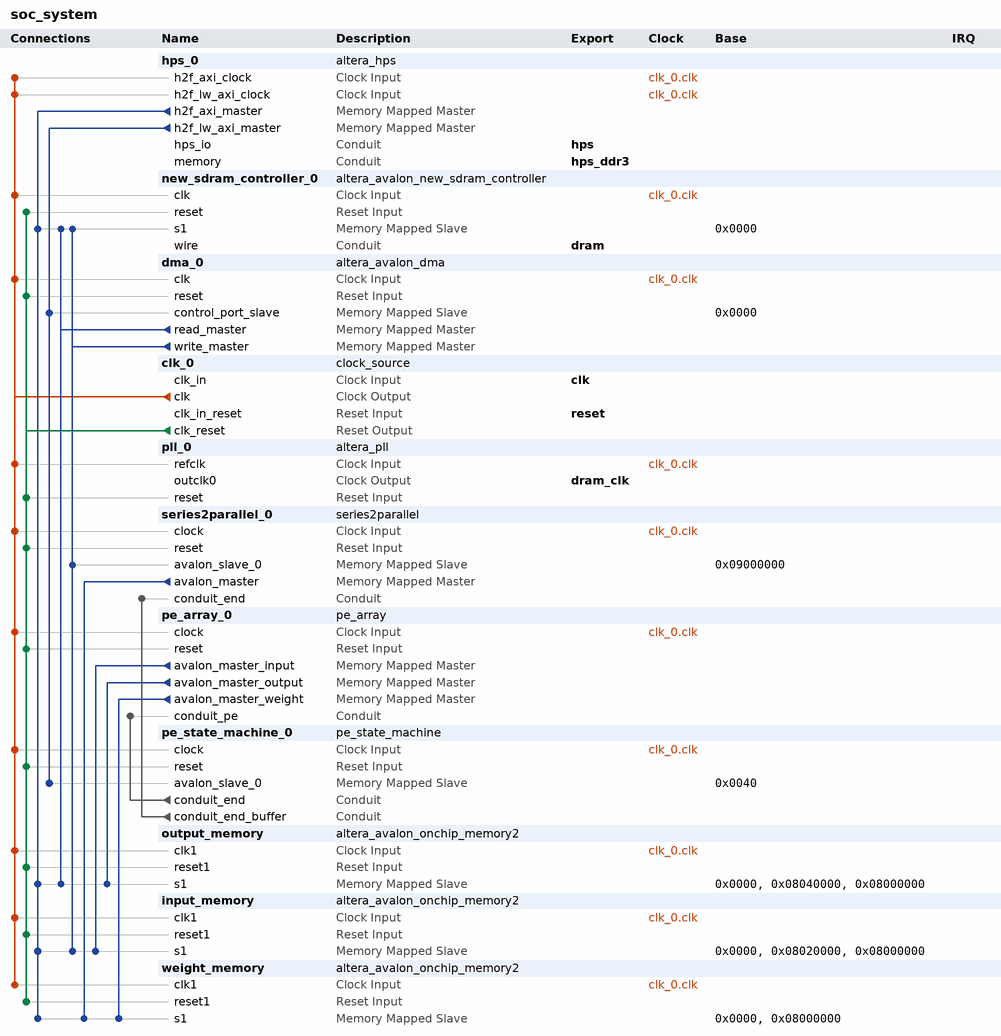
[diagram p0: system contents]
# Platform Designer (Qsys) system soc_system, Cyclone V 5CSEMA5F31C6
# Parameters at their usual value, and those the tool derives, are not listed.
package require -exact qsys 18.1
create_system soc_system
set_project_property DEVICE_FAMILY {Cyclone V}
set_project_property DEVICE 5CSEMA5F31C6

add_instance hps_0 altera_hps 18.1
set_instance_parameter_value hps_0 EMAC1_Mode RGMII
set_instance_parameter_value hps_0 EMAC1_PinMuxing {HPS I/O Set 0}
set_instance_parameter_value hps_0 F2SCLK_COLDRST_Enable false
set_instance_parameter_value hps_0 F2SCLK_DBGRST_Enable false
set_instance_parameter_value hps_0 F2SCLK_WARMRST_Enable false
set_instance_parameter_value hps_0 F2SINTERRUPT_Enable true
set_instance_parameter_value hps_0 F2S_Width 0
set_instance_parameter_value hps_0 FPGA_PERIPHERAL_OUTPUT_CLOCK_FREQ_EMAC0_GTX_CLK 125
set_instance_parameter_value hps_0 FPGA_PERIPHERAL_OUTPUT_CLOCK_FREQ_EMAC0_MD_CLK 2.5
set_instance_parameter_value hps_0 FPGA_PERIPHERAL_OUTPUT_CLOCK_FREQ_EMAC1_GTX_CLK 125
set_instance_parameter_value hps_0 FPGA_PERIPHERAL_OUTPUT_CLOCK_FREQ_EMAC1_MD_CLK 2.5
set_instance_parameter_value hps_0 HPS_PROTOCOL DDR3
set_instance_parameter_value hps_0 I2C0_Mode I2C
set_instance_parameter_value hps_0 I2C0_PinMuxing {HPS I/O Set 0}
set_instance_parameter_value hps_0 I2C1_Mode I2C
set_instance_parameter_value hps_0 I2C1_PinMuxing {HPS I/O Set 0}
set_instance_parameter_value hps_0 LWH2F_Enable true
set_instance_parameter_value hps_0 MEM_BANKADDR_WIDTH 3
set_instance_parameter_value hps_0 MEM_CLK_FREQ 400.0
set_instance_parameter_value hps_0 MEM_COL_ADDR_WIDTH 10
set_instance_parameter_value hps_0 MEM_DQ_WIDTH 32
set_instance_parameter_value hps_0 MEM_DRV_STR RZQ/7
set_instance_parameter_value hps_0 MEM_ROW_ADDR_WIDTH 15
set_instance_parameter_value hps_0 MEM_RTT_NOM RZQ/4
set_instance_parameter_value hps_0 MEM_RTT_WR RZQ/4
set_instance_parameter_value hps_0 MEM_TCL 11
set_instance_parameter_value hps_0 MEM_TFAW_NS 30.0
set_instance_parameter_value hps_0 MEM_TRAS_NS 35.0
set_instance_parameter_value hps_0 MEM_TRCD_NS 13.75
set_instance_parameter_value hps_0 MEM_TRFC_NS 260.0
set_instance_parameter_value hps_0 MEM_TRP_NS 13.75
set_instance_parameter_value hps_0 MEM_VENDOR JEDEC
set_instance_parameter_value hps_0 MEM_WTCL 8
set_instance_parameter_value hps_0 QSPI_Mode {1 SS}
set_instance_parameter_value hps_0 QSPI_PinMuxing {HPS I/O Set 0}
set_instance_parameter_value hps_0 REF_CLK_FREQ 25.0
set_instance_parameter_value hps_0 S2FCLK_USER2CLK 5
set_instance_parameter_value hps_0 S2F_Width 1
set_instance_parameter_value hps_0 SDIO_Mode {4-bit Data}
set_instance_parameter_value hps_0 SDIO_PinMuxing {HPS I/O Set 0}
set_instance_parameter_value hps_0 SPIM1_Mode {Single Slave Select}
set_instance_parameter_value hps_0 SPIM1_PinMuxing {HPS I/O Set 0}
set_instance_parameter_value hps_0 STM_Enable false
set_instance_parameter_value hps_0 TIMING_BOARD_AC_SKEW 0.03
set_instance_parameter_value hps_0 TIMING_BOARD_AC_TO_CK_SKEW 0.0
set_instance_parameter_value hps_0 TIMING_BOARD_DQ_TO_DQS_SKEW 0.0
set_instance_parameter_value hps_0 TIMING_BOARD_MAX_CK_DELAY 0.03
set_instance_parameter_value hps_0 TIMING_BOARD_MAX_DQS_DELAY 0.02
set_instance_parameter_value hps_0 TIMING_BOARD_SKEW_BETWEEN_DQS 0.08
set_instance_parameter_value hps_0 TIMING_BOARD_SKEW_CKDQS_DIMM_MAX 0.16
set_instance_parameter_value hps_0 TIMING_BOARD_SKEW_CKDQS_DIMM_MIN 0.09
set_instance_parameter_value hps_0 TIMING_BOARD_SKEW_WITHIN_DQS 0.01
set_instance_parameter_value hps_0 TIMING_TDH 65
set_instance_parameter_value hps_0 TIMING_TDQSCK 255
set_instance_parameter_value hps_0 TIMING_TDQSQ 120
set_instance_parameter_value hps_0 TIMING_TDS 30
set_instance_parameter_value hps_0 TIMING_TIH 140
set_instance_parameter_value hps_0 TIMING_TIS 180
set_instance_parameter_value hps_0 TIMING_TQSH 0.4
set_instance_parameter_value hps_0 UART0_Mode {No Flow Control}
set_instance_parameter_value hps_0 UART0_PinMuxing {HPS I/O Set 0}
set_instance_parameter_value hps_0 USB1_Mode SDR
set_instance_parameter_value hps_0 USB1_PinMuxing {HPS I/O Set 0}
set_instance_parameter_value hps_0 desired_cfg_clk_mhz 100.0
set_instance_parameter_value hps_0 desired_qspi_clk_mhz 400.0

add_instance new_sdram_controller_0 altera_avalon_new_sdram_controller 18.1
set_instance_parameter_value new_sdram_controller_0 TAC 5.4
set_instance_parameter_value new_sdram_controller_0 TRCD 15.0
set_instance_parameter_value new_sdram_controller_0 TRP 15.0
set_instance_parameter_value new_sdram_controller_0 casLatency 3
set_instance_parameter_value new_sdram_controller_0 columnWidth 10
set_instance_parameter_value new_sdram_controller_0 dataWidth 16
set_instance_parameter_value new_sdram_controller_0 generateSimulationModel false
set_instance_parameter_value new_sdram_controller_0 model single_Micron_MT48LC4M32B2_7_chip
set_instance_parameter_value new_sdram_controller_0 numberOfBanks 4
set_instance_parameter_value new_sdram_controller_0 numberOfChipSelects 1
set_instance_parameter_value new_sdram_controller_0 powerUpDelay 100.0
set_instance_parameter_value new_sdram_controller_0 refreshPeriod 7.8125
set_instance_parameter_value new_sdram_controller_0 rowWidth 13

add_instance dma_0 altera_avalon_dma 18.1
set_instance_parameter_value dma_0 allowByteTransactions true
set_instance_parameter_value dma_0 allowDoubleWordTransactions true
set_instance_parameter_value dma_0 allowHalfWordTransactions true
set_instance_parameter_value dma_0 allowQuadWordTransactions true
set_instance_parameter_value dma_0 burstEnable false
set_instance_parameter_value dma_0 fifoDepth 512
set_instance_parameter_value dma_0 maxBurstSize 128
set_instance_parameter_value dma_0 minimumDmaTransactionRegisterWidth 32

add_instance clk_0 clock_source 18.1
set_instance_parameter_value clk_0 clockFrequency 50000000

add_instance pll_0 altera_pll 18.1
set_instance_parameter_value pll_0 gui_device_speed_grade 2
set_instance_parameter_value pll_0 gui_number_of_clocks 2
set_instance_parameter_value pll_0 gui_operation_mode direct
set_instance_parameter_value pll_0 gui_output_clock_frequency0 50.0
set_instance_parameter_value pll_0 gui_output_clock_frequency1 50.0
set_instance_parameter_value pll_0 gui_phase_shift0 -90
set_instance_parameter_value pll_0 gui_pll_mode {Integer-N PLL}
set_instance_parameter_value pll_0 gui_ps_units0 degrees
set_instance_parameter_value pll_0 gui_reference_clock_frequency 50.0
set_instance_parameter_value pll_0 gui_use_locked true

add_instance series2parallel_0 series2parallel 1.4

add_instance pe_array_0 pe_array 2.0

add_instance pe_state_machine_0 pe_state_machine 1.5

add_instance output_memory altera_avalon_onchip_memory2 18.1
set_instance_parameter_value output_memory dataWidth 16
set_instance_parameter_value output_memory dualPort false
set_instance_parameter_value output_memory initMemContent true
set_instance_parameter_value output_memory initializationFileName onchip_mem.hex
set_instance_parameter_value output_memory memorySize 28928

add_instance input_memory altera_avalon_onchip_memory2 18.1
set_instance_parameter_value input_memory dataWidth 16
set_instance_parameter_value input_memory dualPort false
set_instance_parameter_value input_memory initMemContent true
set_instance_parameter_value input_memory initializationFileName onchip_mem.hex
set_instance_parameter_value input_memory memorySize 115712

add_instance weight_memory altera_avalon_onchip_memory2 18.1
set_instance_parameter_value weight_memory dataWidth 1024
set_instance_parameter_value weight_memory dualPort false
set_instance_parameter_value weight_memory initMemContent true
set_instance_parameter_value weight_memory initializationFileName onchip_mem.hex
set_instance_parameter_value weight_memory memorySize 73856

# connections
add_connection clk_0.clk dma_0.clk clock
add_connection clk_0.clk hps_0.h2f_axi_clock clock
add_connection clk_0.clk hps_0.h2f_lw_axi_clock clock
add_connection clk_0.clk input_memory.clk1 clock
add_connection clk_0.clk new_sdram_controller_0.clk clock
add_connection clk_0.clk output_memory.clk1 clock
add_connection clk_0.clk pe_array_0.clock clock
add_connection clk_0.clk pe_state_machine_0.clock clock
add_connection clk_0.clk pll_0.refclk clock
add_connection clk_0.clk series2parallel_0.clock clock
add_connection clk_0.clk weight_memory.clk1 clock
add_connection clk_0.clk_reset dma_0.reset reset
add_connection clk_0.clk_reset input_memory.reset1 reset
add_connection clk_0.clk_reset new_sdram_controller_0.reset reset
add_connection clk_0.clk_reset output_memory.reset1 reset
add_connection clk_0.clk_reset pe_array_0.reset reset
add_connection clk_0.clk_reset pe_state_machine_0.reset reset
add_connection clk_0.clk_reset pll_0.reset reset
add_connection clk_0.clk_reset series2parallel_0.reset reset
add_connection clk_0.clk_reset weight_memory.reset1 reset
add_connection dma_0.read_master new_sdram_controller_0.s1 avalon
set_connection_parameter_value dma_0.read_master/new_sdram_controller_0.s1 baseAddress 0x0000
add_connection dma_0.read_master output_memory.s1 avalon
set_connection_parameter_value dma_0.read_master/output_memory.s1 baseAddress 0x08000000
add_connection dma_0.write_master input_memory.s1 avalon
set_connection_parameter_value dma_0.write_master/input_memory.s1 baseAddress 0x08000000
add_connection dma_0.write_master new_sdram_controller_0.s1 avalon
set_connection_parameter_value dma_0.write_master/new_sdram_controller_0.s1 baseAddress 0x0000
add_connection dma_0.write_master series2parallel_0.avalon_slave_0 avalon
set_connection_parameter_value dma_0.write_master/series2parallel_0.avalon_slave_0 baseAddress 0x09000000
add_connection hps_0.h2f_axi_master input_memory.s1 avalon
set_connection_parameter_value hps_0.h2f_axi_master/input_memory.s1 baseAddress 0x08020000
add_connection hps_0.h2f_axi_master new_sdram_controller_0.s1 avalon
set_connection_parameter_value hps_0.h2f_axi_master/new_sdram_controller_0.s1 baseAddress 0x0000
add_connection hps_0.h2f_axi_master output_memory.s1 avalon
set_connection_parameter_value hps_0.h2f_axi_master/output_memory.s1 baseAddress 0x08040000
add_connection hps_0.h2f_axi_master weight_memory.s1 avalon
set_connection_parameter_value hps_0.h2f_axi_master/weight_memory.s1 baseAddress 0x08000000
add_connection hps_0.h2f_lw_axi_master dma_0.control_port_slave avalon
set_connection_parameter_value hps_0.h2f_lw_axi_master/dma_0.control_port_slave baseAddress 0x0000
add_connection hps_0.h2f_lw_axi_master pe_state_machine_0.avalon_slave_0 avalon
set_connection_parameter_value hps_0.h2f_lw_axi_master/pe_state_machine_0.avalon_slave_0 baseAddress 0x0040
add_connection pe_array_0.avalon_master_input input_memory.s1 avalon
set_connection_parameter_value pe_array_0.avalon_master_input/input_memory.s1 baseAddress 0x0000
add_connection pe_array_0.avalon_master_output output_memory.s1 avalon
set_connection_parameter_value pe_array_0.avalon_master_output/output_memory.s1 baseAddress 0x0000
add_connection pe_array_0.avalon_master_weight weight_memory.s1 avalon
set_connection_parameter_value pe_array_0.avalon_master_weight/weight_memory.s1 baseAddress 0x0000
add_connection series2parallel_0.avalon_master weight_memory.s1 avalon
set_connection_parameter_value series2parallel_0.avalon_master/weight_memory.s1 baseAddress 0x0000
add_connection pe_state_machine_0.conduit_end pe_array_0.conduit_pe conduit
add_connection pe_state_machine_0.conduit_end_buffer series2parallel_0.conduit_end conduit

# exported interfaces
add_interface clk clock sink
set_interface_property clk EXPORT_OF clk_0.clk_in
add_interface dram conduit end
set_interface_property dram EXPORT_OF new_sdram_controller_0.wire
add_interface dram_clk clock source
set_interface_property dram_clk EXPORT_OF pll_0.outclk0
add_interface hps conduit end
set_interface_property hps EXPORT_OF hps_0.hps_io
add_interface hps_ddr3 conduit end
set_interface_property hps_ddr3 EXPORT_OF hps_0.memory
add_interface reset reset sink
set_interface_property reset EXPORT_OF clk_0.clk_in_reset

set_interconnect_requirement {$system} qsys_mm.clockCrossingAdapter HANDSHAKE
set_interconnect_requirement {$system} qsys_mm.enableEccProtection FALSE
set_interconnect_requirement {$system} qsys_mm.insertDefaultSlave FALSE
set_interconnect_requirement {$system} qsys_mm.maxAdditionalLatency 1

save_system soc_system.qsys
